# Altium schematic sheet Antenna_schematic.SchDoc
size A4
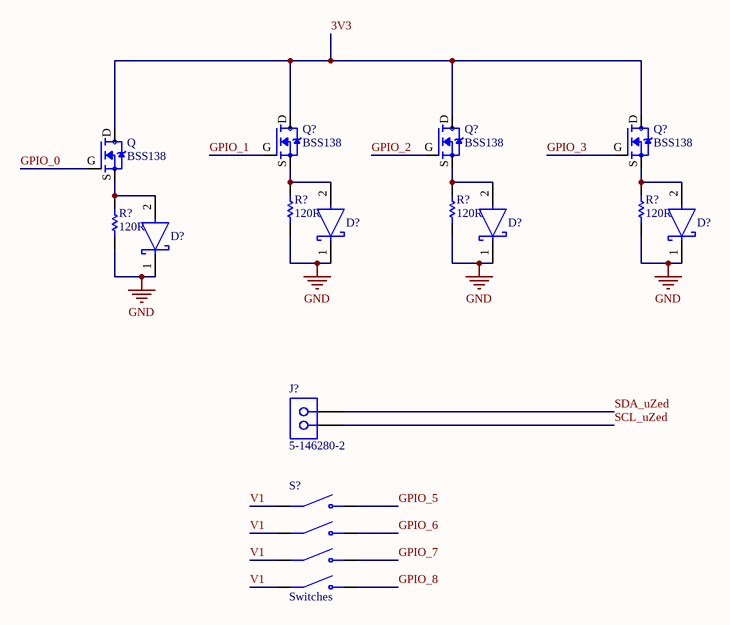
[diagram p0: Antenna_schematic.SchDoc]

## Parts
(Parts that share a designator on the sheet are numbered #1, #2 ... from top to bottom, then left to right.)
D?#1  MBR230LSFT1G  [On_Semiconductor_498_MFG]  (value not drawn)
D?#2  MBR230LSFT1G  [On_Semiconductor_498_MFG]  (value not drawn)
D?#3  MBR230LSFT1G  [On_Semiconductor_498_MFG]  (value not drawn)
D?#4  MBR230LSFT1G  [On_Semiconductor_498_MFG]  (value not drawn)
J?  5-146280-2  [TE_5-146280-2]
Q  BSS138  [SOT95P237X111-3N]
Q?#1  BSS138  [SOT95P237X111-3N]
Q?#2  BSS138  [SOT95P237X111-3N]
Q?#3  BSS138  [SOT95P237X111-3N]
R?#1  120R  [0805]
R?#2  120R  [0805]
R?#3  120R  [0805]
R?#4  120R  [0805]
S?  Switches  [SW_DS04-254-2-04BK-SMT-TR]

## Nets
GND: D?#1.1(C) D?#2.1(C) D?#3.1(C) D?#4.1(C) R?#1.1 R?#2.1 R?#3.1 R?#4.1
3V3: Q.D Q?#1.D Q?#2.D Q?#3.D
GPIO_0: Q.G
GPIO_1: Q?#1.G
GPIO_2: Q?#2.G
GPIO_3: Q?#3.G
GPIO_5: S?.1B(NO1)
GPIO_6: S?.2B(NO2)
GPIO_7: S?.3B(NO3)
GPIO_8: S?.4B(NO4)
SCL_uZed: J?.1
SDA_uZed: J?.2
V1: S?.1A(COM1) S?.2A(COM2) S?.3A(COM3) S?.4A(COM4)
NetD?#1_2: D?#1.2(A) Q?#1.S R?#1.2
NetD?#2_2: D?#2.2(A) Q?#2.S R?#2.2
NetD?#3_2: D?#3.2(A) Q?#3.S R?#3.2
NetD?#4_2: D?#4.2(A) Q.S R?#4.2

## Library data of the parts
J? = 5-146280-2: 02 MODII HDR SRST B/A .100CL; MF: TE Connectivity; Product_Type: Connector; Number_of_Positions: 2; Centerline_Pitch: 2.54 mm[.1 in]; SnapEDA_Link: https://www.snapeda.com/parts/5-146280-2/TE%20Connectivity%20AMP%20Connectors/view-part/298520/?ref=snap; Price: None; EU_RoHS_Compliance: Compliant; Package: None; Availability: Unavailable; TE_purchase_URL: https://www.te.com/usa-en/product-5-146280-2.html?te_bu=Cor&te_type=disp&te_campaign=seda_glo_cor-seda-global-disp-prtnr-fy19-seda-model-bom-cta_sma-317_1&elqCampaignId=32493; Value: *; MP: 5-146280-2
Q Q?#1-Q?#3 = BSS138: N-Channel 50V 220mA (Ta) 360mW (Ta) Surface Mount SOT-23-3; MF: MICROSS/On Semiconductor; DigiKey-Purchase-URL: https://snapeda.com/shop?store=DigiKey&id=2773844; Package: TO-236-3 Micross; Arrow_Electronics-Purchase-URL: https://snapeda.com/shop?store=Arrow+Electronics&id=2773844; Value: *; MP: BSS138; Price: None; SnapEDA_Link: https://www.snapeda.com/parts/BSS138/MICROSS/On%20Semiconductor/view-part/2773844/?ref=snap; Mouser-Purchase-URL: https://snapeda.com/shop?store=Mouser&id=2773844; Availability: Good
R?#1-R?#4 = R120R_1%_1/4W_0805: RES 120R OHM 1/8W 1% 0805; Partnumber: CRGCQ0805F120R; NCM: 8533.21.20
S? = DS04-254-2-04BK-SMT-TR: 1 ~ 12 positions, Surface Mount, 2.54 mm Pitch, Slide Actuator, DIP Switch; MF: CUI Devices; Package: None; Availability: Unavailable; Value: *; MP: DS04-254-2-04BK-SMT-TR; CUI_purchase_URL: https://www.cuidevices.com/product/switches/dip-switches/ds04-254-smt-series?utm_source=snapeda.com&utm_medium=referral&utm_campaign=snapedaBOM; Price: None; SnapEDA_Link: https://www.snapeda.com/parts/DS04-254-2-04BK-SMT-TR/CUI%20Devices/view-part/4467310/?ref=snap; Mouser-Purchase-URL: https://snapeda.com/shop?store=Mouser&id=4467310